# EAGLE design neue_schaltung (EAGLE 6.5.0)
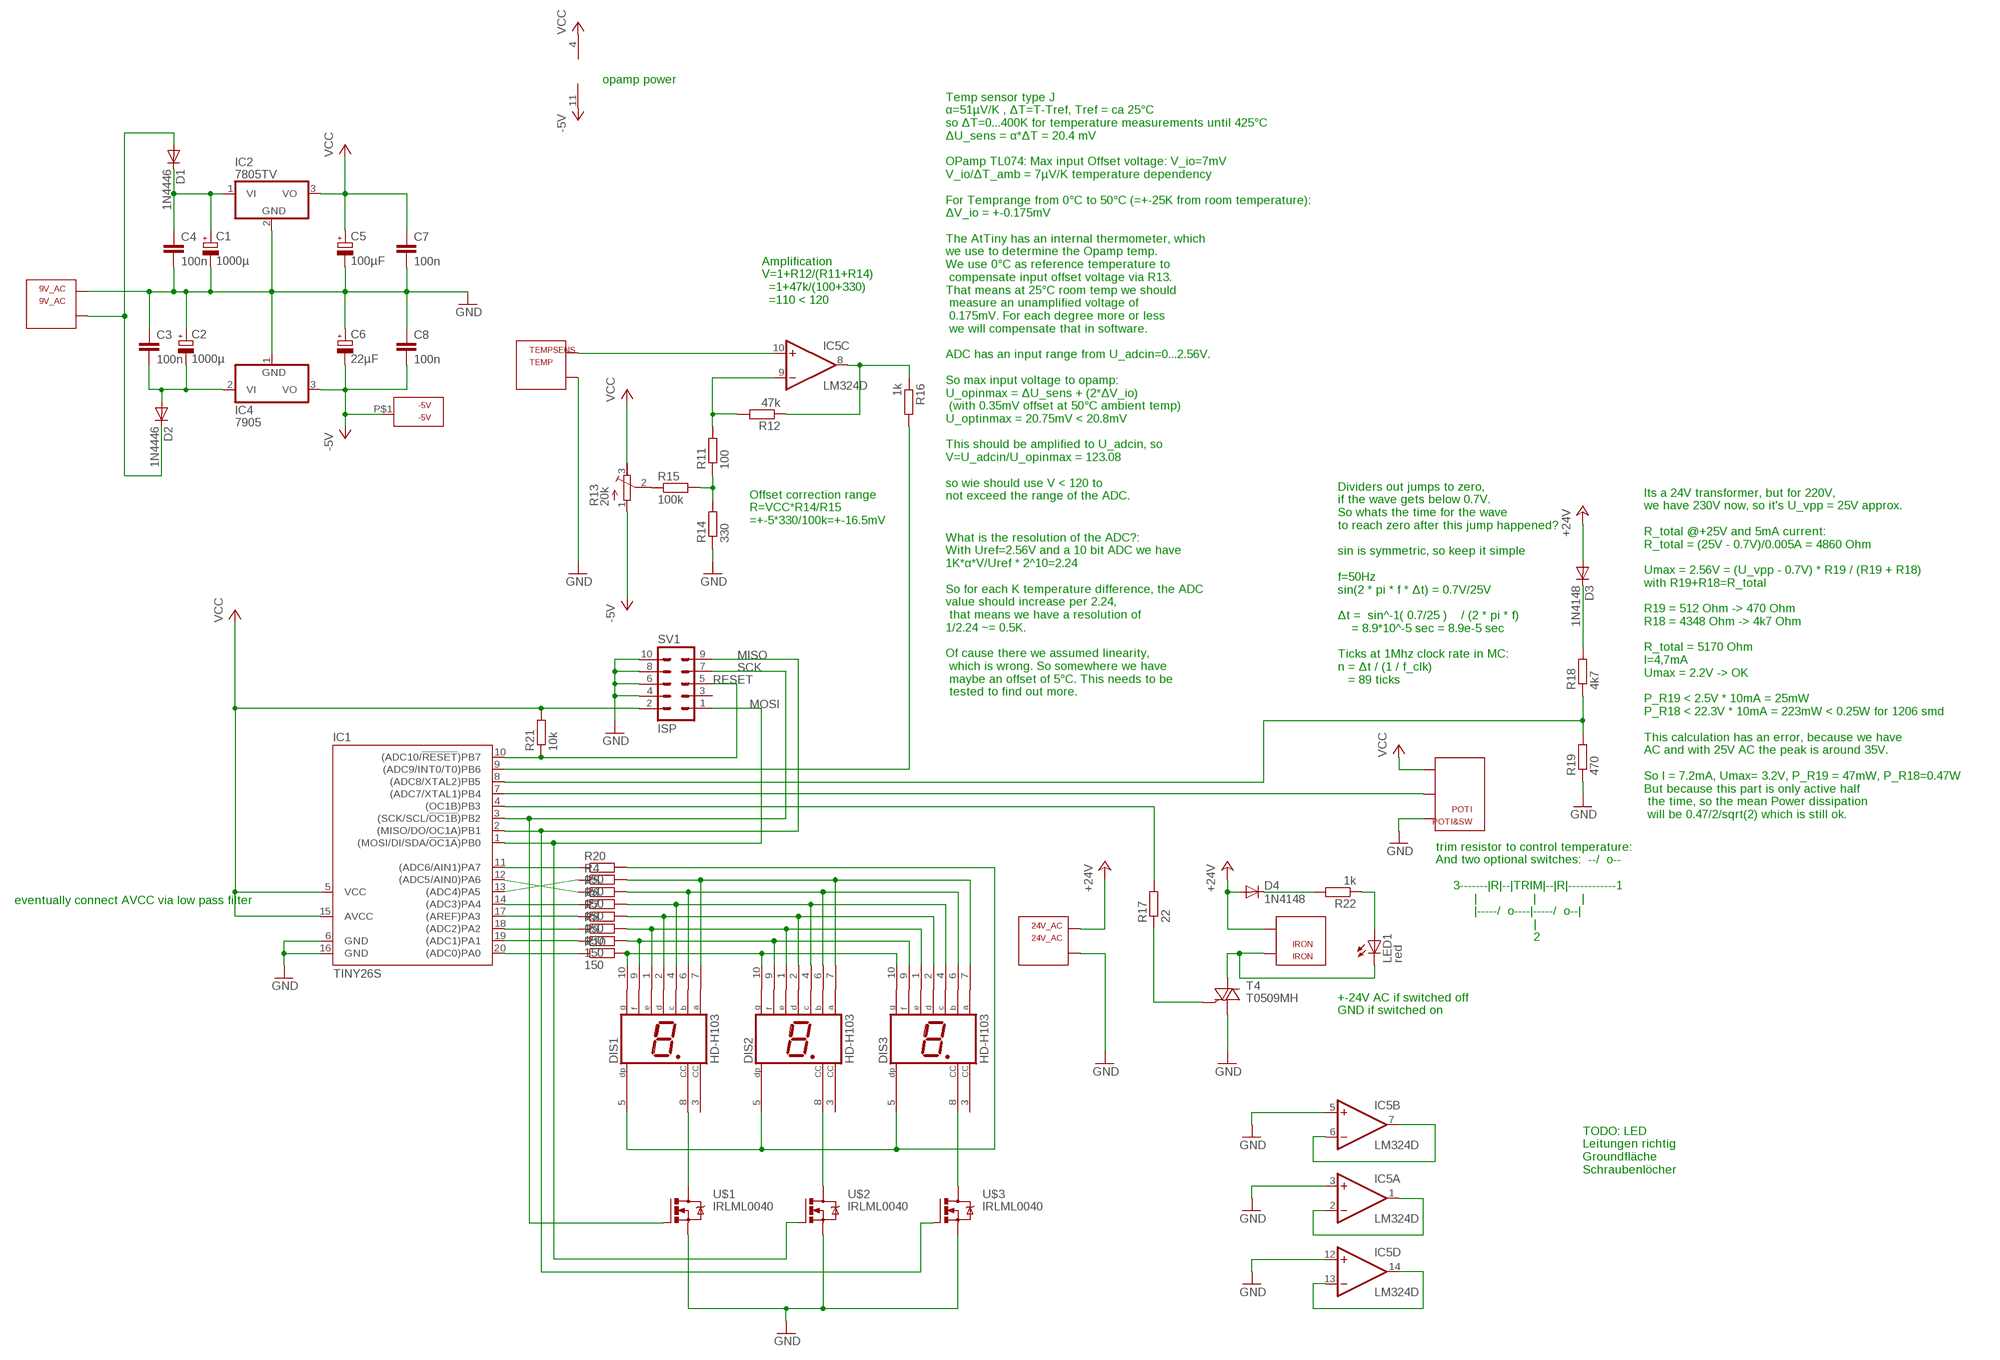
[diagram p0: schematic, sheet 1]

## Parts
9V_AC  9V_AC  WIREPADX2  [WIREPADX2_2H]
24V_AC  24V_AC  WIREPADX2_BIG  [WIREPADX2_2H_BIG]
-5V  -5V  WIREPAD  [WIREPAD_2H]
C1  1000µ  CPOL-EUE5-10.5  [E5-10,5]
C2  1000µ  CPOL-EUE5-10.5  [E5-10,5]
C3  100n  C-EUC0805  [C0805]
C4  100n  C-EUC0805  [C0805]
C5  100µF  CPOL-EUE2-5  [E2-5]
C6  22µF  CPOL-EUE2-5  [E2-5]
C7  100n  C-EUC0805  [C0805]
C8  100n  C-EUC0805  [C0805]
D1  1N4446  [DO35-10]
D2  1N4446  [DO35-10]
D3  1N4148  1N4148DO35-10  [DO35-10]
D4  1N4148  1N4148DO35-10  [DO35-10]
DIS1  HD-H103  [HDSP-M]
DIS2  HD-H103  [HDSP-M]
DIS3  HD-H103  [HDSP-M]
IC1  TINY26S  [SO20L]
IC2  7805TV  [TO220V]
IC4  7905  7905T  [TO220H]
IC5  LM324D  [SO14]
IRON  IRON  WIREPADX2_BIG  [WIREPADX2_2H_BIG]
LED1  red  LED5MM  [LED5MM]
POTI&SW  POTI  WIREPADX3  [WIREPADX3_2H]
R4  150  R-EU_M1206  [M1206]
R5  150  R-EU_M1206  [M1206]
R6  150  R-EU_M1206  [M1206]
R7  150  R-EU_M1206  [M1206]
R8  150  R-EU_M1206  [M1206]
R9  150  R-EU_M1206  [M1206]
R10  150  R-EU_M1206  [M1206]
R11  100  R-EU_M1206  [M1206]
R12  47k  R-EU_M1206  [M1206]
R13  20k  R-TRIMM64W  [RTRIM64W]
R14  330  R-EU_M1206  [M1206]
R15  100k  R-EU_M1206  [M1206]
R16  1k  R-EU_M1206  [M1206]
R17  22  R-EU_M1206  [M1206]
R18  4k7  R-EU_M1206  [M1206]
R19  470  R-EU_M1206  [M1206]
R20  150  R-EU_M1206  [M1206]
R21  10k  R-EU_M1206  [M1206]
R22  1k  R-EU_M1206  [M1206]
SV1  ISP  ML10  [ML10]
T4  T0509MH  BT136  [TO220AB]
TEMPSENS  TEMP  WIREPADX2  [WIREPADX2_2H]
U$1  IRLML0040  [MICRO3]
U$2  IRLML0040  [MICRO3]
U$3  IRLML0040  [MICRO3]

## Nets
+24V: 24V_AC.P$1 D3.A D4.A IRON.P$2
-5V: -5V.P$1 C6.- C8.2 IC4.3(VO) IC5.11(P:V-) R13.1(E)
GND: 9V_AC.P$1 24V_AC.P$2 C1.- C2.+ C3.1 C4.2 C5.- C6.+ C7.2 C8.1 IC1.6(GND) IC1.16(GND) IC2.2(GND) IC4.1(GND) IC5.3(A:+IN) IC5.5(B:+IN) IC5.12(D:+IN) POTI&SW.P$1 R14.1 R19.1 SV1.4 SV1.6 SV1.8 SV1.10 T4.1(A1) TEMPSENS.P$2 U$1.2(S) U$2.2(S) U$3.2(S)
MISO: IC1.2((MISO/DO/OC1A)PB1) SV1.9 U$3.1(G)
MOSI: IC1.1((MOSI/DI/SDA/!OC1A!)PB0) SV1.1 U$2.1(G)
N$1: DIS1.10(G) DIS2.10(G) DIS3.10(G) R10.2
N$2: DIS1.9(F) DIS2.9(F) DIS3.9(F) R9.2
N$3: DIS1.1(E) DIS2.1(E) DIS3.1(E) R8.2
N$4: DIS1.2(D) DIS2.2(D) DIS3.2(D) R7.2
N$5: DIS1.4(C) DIS2.4(C) DIS3.4(C) R6.2
N$6: DIS1.6(B) DIS2.6(B) DIS3.6(B) R5.2
N$7: DIS1.7(A) DIS2.7(A) DIS3.7(A) R4.2
N$8: DIS1.5(DP) DIS2.5(DP) DIS3.5(DP) R20.2
N$9: IC1.12((ADC5/AIN0)PA6) R5.1
N$10: IC1.13((ADC4)PA5) R4.1
N$11: IC1.14((ADC3)PA4) R6.1
N$12: IC1.17((AREF)PA3) R7.1
N$13: IC1.18((ADC2)PA2) R8.1
N$14: IC1.19((ADC1)PA1) R9.1
N$15: IC1.20((ADC0)PA0) R10.1
N$16: DIS1.8(CC) U$1.3(D)
N$17: DIS2.8(CC) U$2.3(D)
N$18: DIS3.8(CC) U$3.3(D)
N$19: IC5.10(C:+IN) TEMPSENS.P$1
N$21: R13.2(S) R15.1
N$22: 9V_AC.P$2 D1.A D2.C
N$24: C2.- C3.2 D2.A IC4.2(VI)
N$25: C1.+ C4.1 D1.C IC2.1(VI)
N$26: IC5.9(C:-IN) R11.2 R12.2
N$27: IC1.9((ADC9/INT0/T0)PB6) R16.2
N$29: R11.1 R14.2 R15.2
N$30: IC5.8(C:OUT) R12.1 R16.1
N$31: IRON.P$1 LED1.K(C) T4.2(A2)
N$32: R17.1 T4.3(G)
N$33: IC1.4((OC1B)PB3) R17.2
N$34: IC1.7((ADC7/XTAL1)PB4) POTI&SW.P$2
N$35: IC1.8((ADC8/XTAL2)PB5) R18.1 R19.2
N$36: D3.C R18.2
N$37: IC1.11((ADC6/AIN1)PA7) R20.1
N$38: D4.C R22.2
N$39: IC5.6(B:-IN) IC5.7(B:OUT)
N$40: IC5.1(A:OUT) IC5.2(A:-IN)
N$41: IC5.13(D:-IN) IC5.14(D:OUT)
N$42: LED1.A R22.1
RESET: IC1.10((ADC10/!RESET!)PB7) R21.1 SV1.5
SCK: IC1.3((SCK/SCL/!OC1B!)PB2) SV1.7 U$1.1(G)
VCC: C5.+ C7.1 IC1.5(VCC) IC1.15(AVCC) IC2.3(VO) IC5.4(P:V+) POTI&SW.P$3 R13.3(A) R21.2 SV1.2
Unconnected: DIS1.3(CC) DIS2.3(CC) DIS3.3(CC) SV1.3

## Notes on the sheet
- opamp power
- Amplification
  V=1+R12/(R11+R14)
    =1+47k/(100+330)
    =110 < 120
- Temp sensor type J
  α=51µV/K , ΔT=T-Tref, Tref = ca 25°C
  so ΔT=0...400K for temperature measurements until 425°C
  ΔU_sens = α*ΔT = 20.4 mV
  
  OPamp TL074: Max input Offset voltage: V_io=7mV
  V_io/ΔT_amb = 7µV/K temperature dependency
  
  For Temprange from 0°C to 50°C (=+-25K from room temperature):
  ΔV_io = +-0.175mV
  
  The AtTiny has an internal thermometer, which
  we use to determine the Opamp temp.
  We use 0°C as reference temperature to
   compensate input offset voltage via R13.
  That means at 25°C room temp we should
   measure an unamplified voltage of
   0.175mV. For each degree more or less
   we will compensate that in software.
  
  ADC has an input range from U_adcin=0...2.56V.
  
  So max input voltage to opamp:
  U_opinmax = ΔU_sens + (2*ΔV_io)
   (with 0.35mV offset at 50°C ambient temp)
  U_optinmax = 20.75mV < 20.8mV
  
  This should be amplified to U_adcin, so
  V=U_adcin/U_opinmax = 123.08
  
  so wie should use V < 120 to 
  not exceed the range of the ADC.
- Offset correction range
  R=VCC*R14/R15
  =+-5*330/100k=+-16.5mV
- Dividers out jumps to zero, 
  if the wave gets below 0.7V.
  So whats the time for the wave 
  to reach zero after this jump happened?
  
  sin is symmetric, so keep it simple
  
  f=50Hz
  sin(2 * pi * f * Δt) = 0.7V/25V
  
  Δt =  sin^-1( 0.7/25 )    / (2 * pi * f) 
      = 8.9*10^-5 sec = 8.9e-5 sec
  
  Ticks at 1Mhz clock rate in MC:
  n = Δt / (1 / f_clk)
     = 89 ticks
- What is the resolution of the ADC?:
  With Uref=2.56V and a 10 bit ADC we have
  1K*α*V/Uref * 2^10=2.24
  
  So for each K temperature difference, the ADC
  value should increase per 2.24,
   that means we have a resolution of 
  1/2.24 ~= 0.5K.
   
  Of cause there we assumed linearity,
   which is wrong. So somewhere we have
   maybe an offset of 5°C. This needs to be
   tested to find out more.
- Its a 24V transformer, but for 220V,
  we have 230V now, so it's U_vpp = 25V approx.
  
  R_total @+25V and 5mA current:
  R_total = (25V - 0.7V)/0.005A = 4860 Ohm
  
  Umax = 2.56V = (U_vpp - 0.7V) * R19 / (R19 + R18) 
  with R19+R18=R_total
  
  R19 = 512 Ohm -> 470 Ohm
  R18 = 4348 Ohm -> 4k7 Ohm
  
  R_total = 5170 Ohm
  I=4,7mA
  Umax = 2.2V -> OK
  
  P_R19 < 2.5V * 10mA = 25mW
  P_R18 < 22.3V * 10mA = 223mW < 0.25W for 1206 smd
  
  This calculation has an error, because we have 
  AC and with 25V AC the peak is around 35V.
  
  So I = 7.2mA, Umax= 3.2V, P_R19 = 47mW, P_R18=0.47W
  But because this part is only active half
   the time, so the mean Power dissipation
   will be 0.47/2/sqrt(2) which is still ok.
- eventually connect AVCC via low pass filter
- trim resistor to control temperature:
  And two optional switches:  --/  o--
  
       3-------|R|--|TRIM|--|R|------------1
             |                |             |
             |-----/  o----|-----/  o--|
                              |
                              2
- +-24V AC if switched off
  GND if switched on
- TODO: LED
  Leitungen richtig
  Groundfläche
  Schraubenlöcher

## Library data of the parts
9V_AC TEMPSENS = pxwirepad:WIREPADX2
24V_AC IRON = pxwirepad:WIREPADX2_BIG
-5V = pxwirepad:WIREPAD: Wirepad with strain relief
C1 C2 C5 C6 = rcl:CPOL-EU: POLARIZED CAPACITOR, European symbol
C3 C4 C7 C8 = rcl:C-EU: CAPACITOR, European symbol
D1 D2 = diode:1N4446: DIODE high speed (Philips)
D3 D4 = diode:1N4148: DIODE high speed (Philips)
DIS1-DIS3 = display-hp:HD-H103: LED DISPLAY 1-character 7 segment, decimal point right; OC_FARNELL: unknown; OC_NEWARK: unknown
IC1 = atmel:TINY26*: 8-bit AVR Microcontroller with 2K Bytes Flash Source: http://www.atmel.com .. doc1477.pdf; MPN: ATTINY261-20SU; OC_FARNELL: 1455147; OC_NEWARK: 58M3783
IC2 = linear:78*: Positive VOLTAGE REGULATOR Source: http://cache.national.com/ds/LM/LM78L05.pdf http://www.fairchildsemi.com/ds/LM/LM7805.pdf
IC4 = linear:79*: Negative VOLTAGE REGULATOR
IC5 = linear:LM324: OP AMP
LED1 = led:LED: LED OSRAM: - CHIPLED LG R971, LG N971, LY N971, LG Q971, LY Q971, LO R971, LY R971 LH N974, LH R974 LS Q976, LO Q976, LY Q976 LO Q996 - Hyper CHIPLED LW Q18S LB Q993, LB Q99A, LB R99A - SideLED LS A670, LO A670, LY A670, LG A670, LP A670 LB A673, LV A673, LT A673, LW A673 LH A674 LY A675 LS A676, LA A676, LO A676, LY A676, LW A676 LS A679, LY A679, LG A679 - Hyper Micro SIDELED® LS Y876, LA Y876, LO Y876, LY Y876 LT Y87S - SmartLED LW L88C, LW L88S LB L89C, LB L89S, LG L890 LS L89K, LO L89K, LY L89K LS L896, LA L896, LO L896, LY L896 - TOPLED LS T670, LO T670, LY T670, LG T670, LP T670 LSG T670, LSP T670, LSY T670, LOP T670, LYG T670 LG T671, LOG T671, LSG T671 LB T673, LV T673, LT T673, LW T673 LH T674 LS T676, LA T676, LO T676, LY T676, LB T676, LH T676, LSB T676, LW T676 LB T67C, LV T67C, LT T67C, LS T67K, LO T67K, LY T67K, LW E67C LS E67B, LA E67B, LO E67B, LY E67B, LB E67C, LV E67C, LT E67C LW T67C LS T679, LY T679, LG T679 LS T770, LO T770, LY T770, LG T770, LP T770 LB T773, LV T773, LT T773, LW T773 LH T774 LS E675, LA E675, LY E675, LS T675 LS T776, LA T776, LO T776, LY T776, LB T776 LHGB T686 LT T68C, LB T68C - Hyper Mini TOPLED® LB M676 - Mini TOPLED Santana® LG M470 LS M47K, LO M47K, LY M47K Source: http://www.osram.convergy.de LUXEON: - LUMILED® LXK2-PW12-R00, LXK2-PW12-S00, LXK2-PW14-U00, LXK2-PW14-V00 LXK2-PM12-R00, LXK2-PM12-S00, LXK2-PM14-U00 LXK2-PE12-Q00, LXK2-PE12-R00, LXK2-PE12-S00, LXK2-PE14-T00, LXK2-PE14-U00 LXK2-PB12-K00, LXK2-PB12-L00, LXK2-PB12-M00, LXK2-PB14-N00, LXK2-PB14-P00, LXK2-PB14-Q00 LXK2-PR12-L00, LXK2-PR12-M00, LXK2-PR14-Q00, LXK2-PR14-R00 LXK2-PD12-Q00, LXK2-PD12-R00, LXK2-PD12-S00 LXK2-PH12-R00, LXK2-PH12-S00 LXK2-PL12-P00, LXK2-PL12-Q00, LXK2-PL12-R00 Source: www.luxeon.com KINGBRIGHT: KA-3528ASYC Source: www.kingbright.com
POTI&SW = pxwirepad:WIREPADX3
R4-R12 R14-R22 = rcl:R-EU_: RESISTOR, European symbol
R13 = resistor:R-TRIMM: Trimm resistor
SV1 = con-ml:ML10: HARTING; OC_FARNELL: unknown; OC_NEWARK: unknown
T4 = triac:BT136: Triac BT136 series E sensitive gate Source: http://www.nxp.com/acrobat_download/datasheets/BT136_SERIES_E_2.pdf
U$1-U$3 = mosfet:IRLML0040

## Board
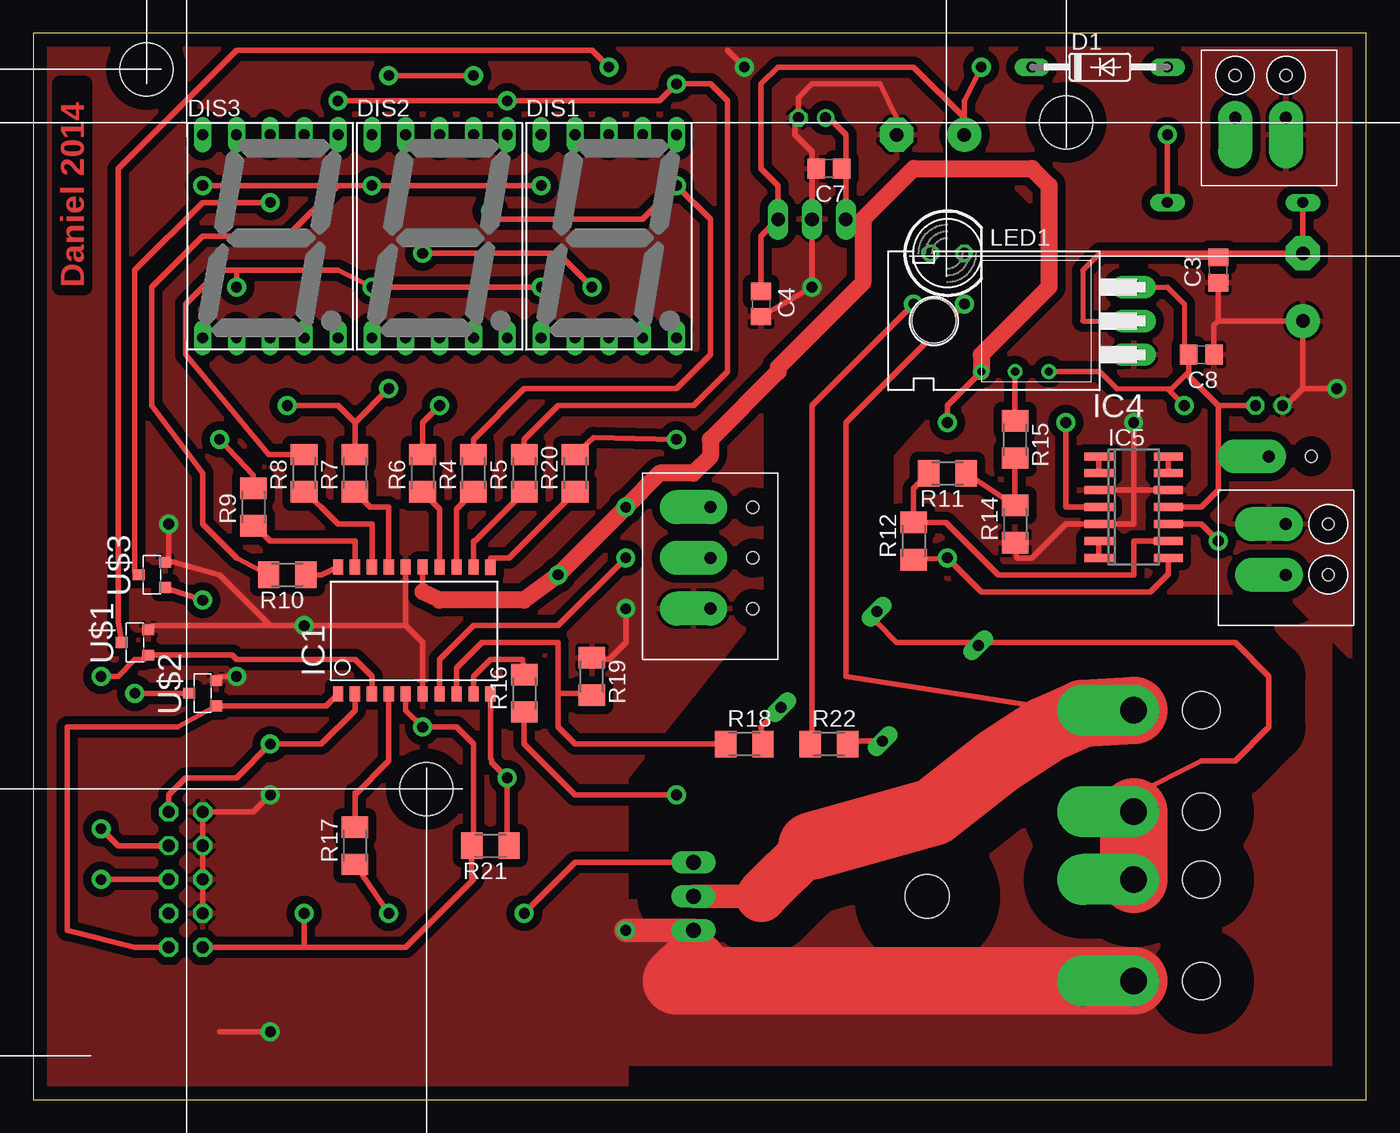
[diagram p1: board, top side]
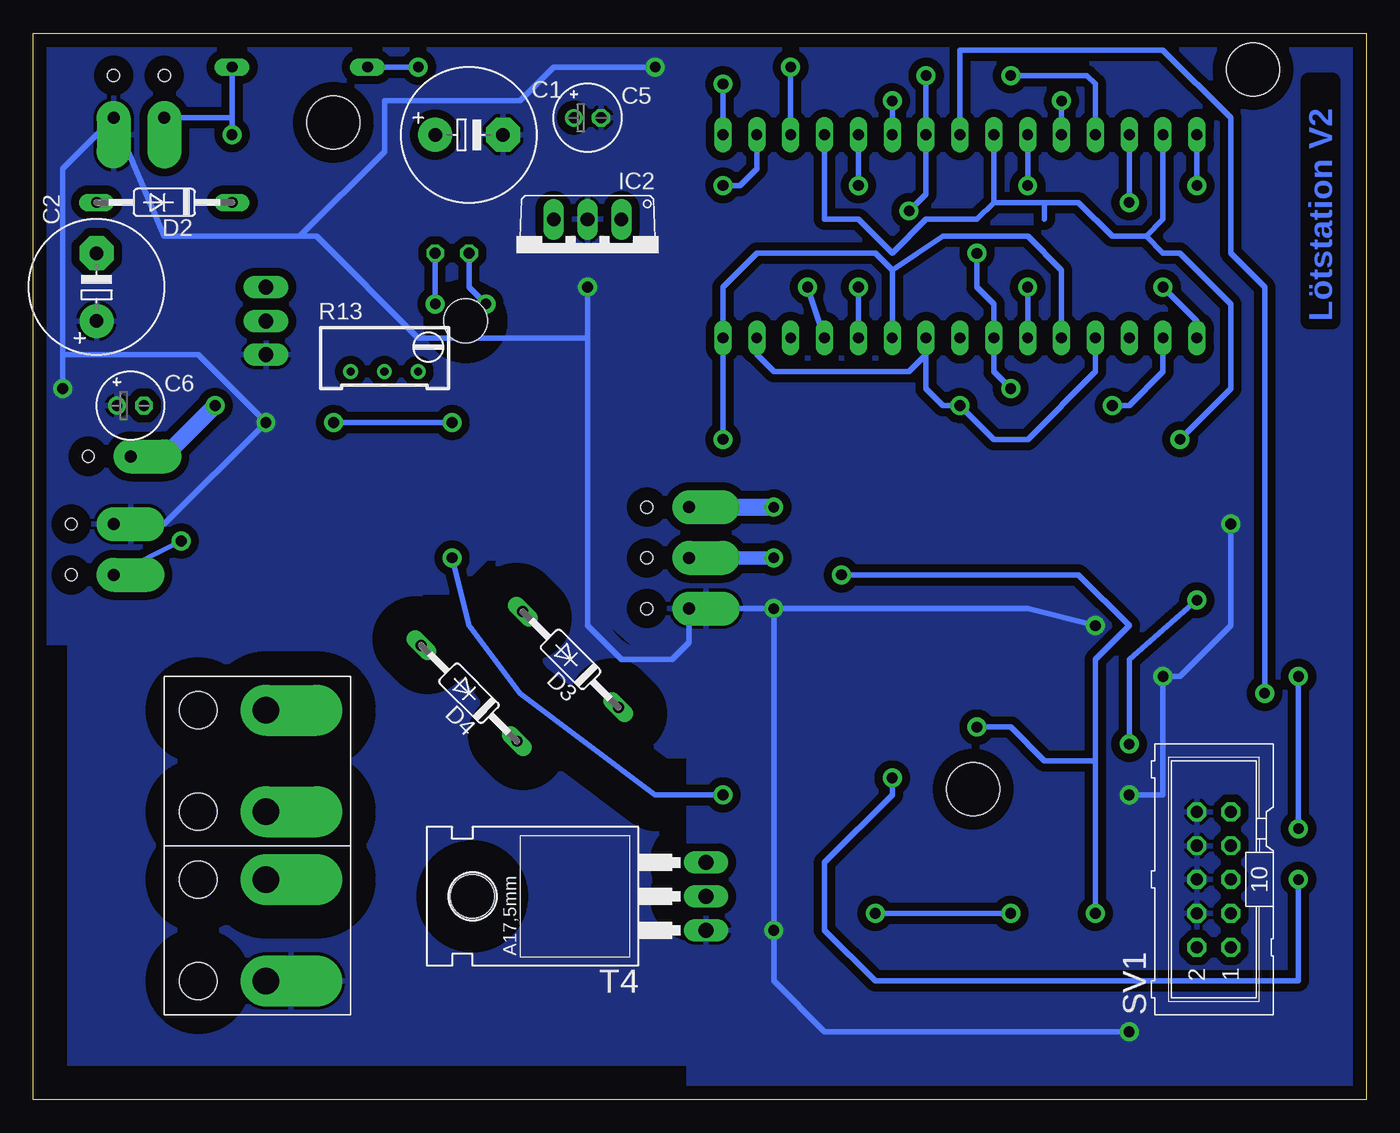
[diagram p2: board, bottom side, seen from below]

Size 100 x 80 mm. Coordinates in mm from the lower left corner, seen from the top.
Outline: 0,0 100,0 100,80 0,80 0,0
Copper layers (1*16): Top 0.035mm / dielectric 1.5mm / Bottom 0.035mm
Design rules "default": minimum track width 10mil, minimum drill 24mil, track to track 8mil, track to pad 8mil, pad to pad 8mil, via to via 8mil, smd to smd 8mil, copper to edge 40mil, drill to drill 8mil, minimum pad ring 10mil, minimum via ring 8mil, stop-mask expansion 4mil, vias tented up to drill 0mil, thermal gap 10mil
Holes 4 mm at 8.5,77.3 77.5,73.3 29.5,23.3

### Footprints (pad centres in the part's own frame; a part is rotated, then mirrored left to right if it is on the bottom)
WIREPADX2_2H = drill 0.9 pad 2.54 offset: P$1 0,0; P$2 0,-3.81 | hole 0.9: -3.175,0; -3.175,-3.81
WIREPADX2_2H_BIG = drill 2 pad 3.81 offset: P$1 0,0; P$2 0,-7.62 | hole 2.8: -5.08,0; -5.08,-7.62
WIREPAD_2H = drill 0.9 pad 2.54 offset: P$1 2.54,0 | hole 0.9: -0.635,0
E5-10,5 = drill 1.016 pad 2.54: + -2.54,0 | drill 1.016 pad 2.54 octagon: - 2.54,0
C0805 = smd 1.3 x 1.5: 1 -0.95,0; 2 0.95,0
E2-5 = drill 0.813 pad 1.27: + -1.016,0 | drill 0.813 pad 1.27 octagon: - 1.016,0
DO35-10 = drill 0.813 long: A 5.08,0; C -5.08,0
HDSP-M = drill 0.813 long: 1 -5.08,-7.62; 2 -2.54,-7.62; 3 0,-7.62; 4 2.54,-7.62; 5 5.08,-7.62; 6 5.08,7.62; 7 2.54,7.62; 8 0,7.62; 9 -2.54,7.62; 10 -5.08,7.62
SO20L = smd 0.762 x 1.143: 1 -5.08,-5.131; 2 -3.81,-5.131; 3 -2.54,-5.131; 4 -1.27,-5.131; 5 0,-5.131; 6 1.27,-5.131; 7 2.54,-5.131; 8 3.81,-5.131; 9 5.08,-5.131; 10 6.35,-5.131; 11 6.35,4.369; 12 5.08,4.394; 13 3.81,4.394; 14 2.54,4.394; 15 1.27,4.394; 16 0,4.394; 17 -1.27,4.394; 18 -2.54,4.394; 19 -3.81,4.394; 20 -5.08,4.394
TO220V = drill 1.016 long: 1 -2.54,-2.54; 2 0,-2.54; 3 2.54,-2.54
TO220H = drill 1.118 long: 1 -2.54,-10.16; 2 0,-10.16; 3 2.54,-10.16 | hole 3.302: 0,4.826
SO14 = smd 0.6 x 2.2: 1 -3.81,-2.6; 2 -2.54,-2.6; 3 -1.27,-2.6; 4 0,-2.6; 5 1.27,-2.6; 6 2.54,-2.6; 7 3.81,-2.6; 8 3.81,2.6; 9 2.54,2.6; 10 1.27,2.6; 11 0,2.6; 12 -1.27,2.6; 13 -2.54,2.6; 14 -3.81,2.6
LED5MM = drill 0.813 octagon: A -1.27,0; K 1.27,0
WIREPADX3_2H = drill 0.9 pad 2.54 offset: P$1 0,0; P$2 0,-3.81; P$3 0,-7.62 | hole 0.9: -3.175,0; -3.175,-3.81; -3.175,-7.62
M1206 = smd 1.6 x 2: 1 -1.4,0; 2 1.4,0
RTRIM64W = drill 0.61: 1 1.27,-2.54; 2 1.27,0; 3 1.27,2.54
ML10 = drill 0.914 octagon: 1 -5.08,-1.27; 2 -5.08,1.27; 3 -2.54,-1.27; 4 -2.54,1.27; 5 0,-1.27; 6 0,1.27; 7 2.54,-1.27; 8 2.54,1.27; 9 5.08,-1.27; 10 5.08,1.27
TO220AB = drill 1.118 long: 1 -2.54,-6.35; 2 0,-6.35; 3 2.54,-6.35 | hole 3.302: 0,11.176
MICRO3 = smd 0.8 x 0.9: 1 -0.95,-1; 2 0.95,-1; 3 0,1

### Placement (x,y rotation side)
9V_AC  93.98,73.66 270 top
24V_AC  82.55,16.51 0 bottom
-5V  95.25,48.26 180 top
C1  67.31,72.39 0 bottom
C2  95.25,60.96 90 bottom
C3  88.9,62.23 90 top
C4  54.61,59.69 270 top
C5  58.42,73.66 0 bottom
C6  92.71,52.07 0 bottom
C7  59.69,69.85 180 top
C8  87.63,55.88 180 top
D1  80.01,77.47 0 top
D2  90.17,67.31 180 bottom
D3  59.69,33.02 135 bottom
D4  67.31,30.48 135 bottom
DIS1  43.18,64.77 0 top
DIS2  30.48,64.77 0 top
DIS3  17.78,64.77 0 top
IC1  27.94,35.56 0 top
IC2  58.42,63.5 180 bottom
IC4  72.39,58.42 90 top
IC5  82.55,44.45 270 top
IRON  82.55,29.21 0 bottom
LED1  68.58,63.5 0 top
POTI&SW  50.8,36.83 180 top
R4  33.02,46.99 90 top
R5  36.83,46.99 90 top
R6  29.21,46.99 90 top
R7  24.13,46.99 90 top
R8  20.32,46.99 90 top
R9  16.51,44.45 90 top
R10  19.05,39.37 180 top
R11  68.58,46.99 180 top
R12  66.04,41.91 90 top
R13  73.66,55.88 270 bottom
R14  73.66,43.18 90 top
R15  73.66,49.53 270 top
R16  36.83,30.48 90 top
R17  24.13,19.05 90 top
R18  53.34,26.67 0 top
R19  41.91,31.75 270 top
R20  40.64,46.99 90 top
R21  34.29,19.05 180 top
R22  59.69,26.67 0 top
SV1  11.43,16.51 90 bottom
T4  55.88,15.24 90 bottom
TEMPSENS  93.98,39.37 180 top
U$1  7.62,34.29 90 top
U$2  12.7,30.48 90 top
U$3  8.89,39.37 90 top

### Tracks (layer width: path | path; a pad name or v marks a point on that pad's centre or on a via)
+24V
  Top 0.406: IRON.P$2 82.55,22.86 87.63,25.4 90.17,25.4 92.71,27.94 92.71,31.75 90.17,34.29 71.12,34.29 | D3.A 63.28,35.78 64.77,34.29 71.12,34.29 | 71.12,34.29 D4.A | D4.A | D4.A 71.12,34.29
  Top 5.08: IRON.P$2 24V_AC.P$1
-5V  (via drill 0.8 pad 1.42)
  Top 0.375: IC4.3 85.09,60.96 86.36,59.69 86.36,56.2 C8.2 | 80.01,54.61 81.28,53.34 85.09,53.34 | 85.09,53.34 v86.36,52.07 | 85.09,53.34 85.41,53.34 86.68,54.61
  Top 0.406: C8.2 86.68,54.61 86.68,54.29 88.9,52.07 | 88.9,52.07 C6.- | 88.9,52.07 88.9,45.72 87.63,44.45 IC5.11 | R13.1 80.01,54.61
  Bottom 1.27: -5V.P$1 90.17,48.26 v86.36,52.07
GND  (via drill 0.8 pad 1.42)
  Top 0.406: 17.78,35.56 13.97,39.37 10.48,40.32 U$3.2 10.16,40.59 v10.16,43.18 | IC1.16 27.94,35.56 | 27.94,35.56 29.21,34.29 IC1.6 | 17.78,35.56 8.94,35.56 U$1.2 | v15.24,31.75 14.02,31.75 U$2.2 | C4.2 v58.42,60.96 IC2.2 58.42,69.85 | 58.42,69.85 58.42,71.12 57.15,72.39 57.15,73.41 C5.- 57.4,75.18 58.42,76.2 63.5,76.2 64.77,73.66 C1.- | 88.9,58.42 C2.+ 95.25,53.34 | C8.1 88.58,58.1 88.9,58.42 | 88.9,58.42 C3.1 | C6.+ 93.98,52.07 95.25,53.34 | 82.55,45.72 IC5.12 | IC5.3 82.55,45.72 | 82.55,45.72 82.55,43.18 IC5.5 77.47,43.18 74.93,40.64 73.79,40.64 R14.1 | v97.79,53.34 95.25,53.34 | v82.55,50.8 82.55,45.72 | SV1.4 SV1.6 SV1.8 SV1.10 16.51,21.59 v17.78,22.86 | C7.2 58.42,69.85 | v44.45,36.83 44.45,34.29 43.18,33.02 42.04,33.02 R19.1 | 17.78,35.56 v20.32,35.56 27.94,35.56 | v17.78,5.08 13.97,5.08 | v53.34,77.47 52.07,78.74
  Top 1.778: 49.53,10.16 T4.1 v44.45,12.7
  Top 5.08: 49.53,10.16 48.26,8.89 24V_AC.P$2
  Bottom 0.406: v10.16,43.18 10.16,35.56 13.97,31.75 v15.24,31.75 15.24,22.86 v17.78,22.86 | 80.01,64.77 90.17,64.77 9V_AC.P$1 97.79,69.85 97.79,55.88 | 80.01,64.77 78.74,64.77 71.12,57.15 58.42,57.15 | 97.79,55.88 v97.79,53.34 | 97.79,55.88 87.63,55.88 v82.55,50.8 90.17,43.18 TEMPSENS.P$2 | v58.42,60.96 58.42,57.15 | 58.42,57.15 58.42,35.56 55.88,33.02 52.07,33.02 50.8,34.29 POTI&SW.P$1 v44.45,36.83 | v44.45,36.83 25.4,36.83 v20.32,35.56 | v44.45,36.83 v44.45,12.7 44.45,8.89 40.64,5.08 v17.78,5.08 | 80.01,64.77 73.66,71.12 73.66,74.93 63.5,74.93 60.96,77.47 v53.34,77.47
  pour Bottom (isolate 0.61): 0,80.01 0,0 50.8,0 50.8,30.48 62.23,40.64 66.04,40.64 68.58,38.1 74.93,38.1 78.74,34.29 100.33,34.29 100.33,80.01
  pour Bottom (isolate 2.54): 50.8,0 100.33,0 100.33,34.29 78.74,34.29 74.93,38.1 68.58,38.1 66.04,40.64 62.23,40.64 60.96,39.37 50.8,30.48
  pour Top (isolate 0.61): 0,80.01 100.33,80.01 100.33,31.75 93.98,38.1 71.12,38.1 64.77,40.64 64.77,48.26 74.93,59.69 74.93,67.31 72.39,69.85 66.04,69.85 62.23,66.04 62.23,60.96 54.61,53.34 54.61,36.83 44.45,24.13 44.45,0 0,0
  pour Top (isolate 2.54): 44.45,0 44.45,24.13 55.88,38.1 100.33,38.1 100.33,0
MISO  (via drill 0.8 pad 1.42)
  Top 0.406: U$3.1 9.89,38.37 v12.7,37.47 | IC1.2 24.13,29.21 21.59,26.67 v17.78,26.67 15.24,24.13 11.43,24.13 10.16,22.86 SV1.9
  Bottom 0.406: v12.7,37.47 17.78,33.02 v17.78,26.67
MOSI
  Top 0.406: IC1.1 21.96,29.53 U$2.1 10.84,27.94 2.54,27.94 2.54,12.7 7.62,11.43 SV1.1
N$1  (via drill 0.8 pad 1.42)
  Top 0.406: R10.2 15.24,40.64 12.7,43.18 12.7,46.99 8.89,52.07 8.89,60.96 12.7,64.77 19.05,64.77 22.86,68.58 | 22.86,68.58 v12.7,68.58 | 22.86,68.58 v25.4,68.58 v38.1,68.58
  Bottom 0.406: v12.7,68.58 DIS3.10 | v25.4,68.58 DIS2.10 | DIS1.10 v38.1,68.58
N$2  (via drill 0.8 pad 1.42)
  Top 0.406: v13.97,49.53 16.51,46.86 R9.2
  Bottom 0.406: 16.51,64.77 15.24,66.04 DIS3.9 | 16.51,64.77 19.05,64.77 21.59,67.31 24.13,67.31 | 24.13,67.31 27.94,67.31 | DIS2.9 27.94,67.31 | 27.94,67.31 29.21,66.04 33.02,66.04 35.56,63.5 38.1,66.04 40.64,66.04 DIS1.9 | 24.13,66.04 24.13,67.31 | 16.51,64.77 15.24,63.5 13.97,63.5 10.16,59.69 10.16,53.34 v13.97,49.53
N$3  (via drill 0.8 pad 1.42)
  Top 0.406: 15.24,62.23 22.86,62.23 v25.4,60.96 v38.1,60.96 | 15.24,62.23 v15.24,60.96 | R8.2 17.65,48.39 11.43,55.88 11.43,59.69 13.97,62.23 15.24,62.23
  Bottom 0.406: DIS2.1 v25.4,60.96 | v15.24,60.96 12.7,58.42 DIS3.1 | DIS1.1 v38.1,60.96
N$4  (via drill 0.8 pad 1.42)
  Top 0.406: v29.21,63.5 39.37,63.5 v41.91,60.96 | R7.2 24.13,50.8 | 24.13,50.8 v26.67,53.34 | 24.13,50.8 22.86,52.07 v19.05,52.07
  Bottom 0.406: DIS1.2 v41.91,60.96 | v29.21,63.5 29.21,60.96 27.94,59.69 DIS2.2 27.94,54.61 v26.67,53.34 | v19.05,52.07 17.78,52.07 15.24,54.61 DIS3.2
N$5  (via drill 0.8 pad 1.42)
  Top 0.406: R6.2 29.21,50.8 v30.48,52.07
  Bottom 0.406: DIS1.4 45.72,55.88 44.45,54.61 34.29,54.61 33.02,55.88 DIS2.4 33.02,53.34 31.75,52.07 v30.48,52.07 27.94,49.53 25.4,49.53 20.32,54.61 DIS3.4
N$6  (via drill 0.8 pad 1.42)
  Top 0.406: R5.2 36.83,49.53 39.37,52.07 49.53,52.07 52.07,54.61 52.07,74.93 50.8,76.2 v48.26,76.2 46.99,74.93 v35.56,74.93 v22.86,74.93
  Bottom 0.406: v35.56,74.93 DIS2.6 | DIS1.6 v48.26,76.2 | DIS3.6 v22.86,74.93
N$7  (via drill 0.8 pad 1.42)
  Top 0.406: R4.2 33.02,49.53 36.83,53.34 48.26,53.34 50.8,55.88 50.8,66.04 v48.26,68.58 45.72,66.04 34.92,66.04 v34.29,66.67 | v26.67,76.83 v33.02,76.83
  Bottom 0.406: v48.26,68.58 46.99,68.58 45.72,69.85 DIS1.7 | DIS3.7 20.32,76.2 20.95,76.83 v26.67,76.83 | v33.02,76.83 DIS2.7 33.02,67.94 v34.29,66.67
N$8  (via drill 0.8 pad 1.42)
  Top 0.406: R20.2 42.04,49.66 v48.26,49.53
  Bottom 0.406: DIS3.5 22.86,62.23 25.4,64.77 31.75,64.77 35.56,62.23 | 35.56,62.23 DIS2.5 | 35.56,62.23 36.83,63.5 45.72,63.5 48.26,60.96 DIS1.5 v48.26,49.53
N$9
  Top 0.406: IC1.12 33.02,41.91 33.15,41.91 R5.1
N$10
  Top 0.406: IC1.13 31.75,44.32 R4.1
N$11
  Top 0.406: IC1.14 30.48,44.32 R6.1
N$12
  Top 0.406: IC1.17 26.67,44.45 25.27,44.45 R7.1
N$13
  Top 0.406: IC1.18 25.4,43.18 22.86,43.18 21.59,44.45 R8.1
N$14
  Top 0.406: IC1.19 24.13,41.91 17.78,41.91 16.64,43.05 R9.1
N$15
  Top 0.406: IC1.20 21.59,39.37 R10.1
N$16  (via drill 0.8 pad 1.42)
  Top 0.406: v43.18,77.47 41.91,78.74 15.24,78.74 6.35,69.85 6.35,35.83 U$1.3
  Bottom 0.406: v43.18,77.47 DIS1.8
N$17  (via drill 0.8 pad 1.42)
  Top 0.406: v7.62,30.48 U$2.3
  Bottom 0.406: DIS2.8 30.48,78.74 15.24,78.74 10.16,73.66 10.16,63.5 7.62,60.96 v7.62,30.48
N$18  (via drill 0.8 pad 1.42)
  Top 0.406: v17.78,67.31 12.7,67.31 7.62,62.23 7.62,39.64 U$3.3
  Bottom 0.406: DIS3.8 v17.78,67.31
N$19  (via drill 0.8 pad 1.42)
  Top 0.406: IC5.10 87.63,43.18 v88.9,41.91
  Bottom 0.406: v88.9,41.91 TEMPSENS.P$1
N$21
  Top 0.406: R15.1 R13.2
N$22  (via drill 0.8 pad 1.42)
  Top 0.406: v85.09,72.39 D2.C
  Bottom 0.406: 9V_AC.P$2 85.09,73.66 | D1.A 85.09,73.66 | 85.09,73.66 v85.09,72.39
N$24
  Top 0.375: 85.09,63.5 80.01,63.5 78.74,62.23 78.74,58.42 IC4.2 | C3.2 86.68,63.18 86.36,63.5
  Top 0.406: D2.A C2.- 86.36,63.5 85.09,63.5
N$25  (via drill 0.8 pad 1.42)
  Top 0.406: C4.1 54.61,64.77 IC2.1 55.88,68.58 54.61,69.85 54.61,76.2 55.88,77.47 66.04,77.47 69.85,73.66 C1.+ 69.85,74.93 v71.12,77.47
  Bottom 0.406: v71.12,77.47 D1.C
N$26
  Top 0.406: IC5.9 82.55,41.91 82.55,39.37 72.39,39.37 68.45,43.31 R12.2 66.04,45.85 R11.2
N$27
  Top 0.406: IC1.9 33.02,31.75 34.29,33.02 36.7,33.02 R16.2
N$29
  Top 0.406: R15.2 R14.2 R11.1
N$30  (via drill 0.8 pad 1.42)
  Top 0.406: IC5.8 85.15,39.43 83.82,38.1 71.12,38.1 v68.58,40.64 68.71,40.64 R12.1 | R16.1 36.83,26.67 40.64,22.86 v48.26,22.86
  Bottom 0.406: v48.26,22.86 53.34,22.86 63.5,30.48 67.31,35.56 v68.58,40.64
N$31  (via drill 0.8 pad 1.42)
  Top 0.406: v69.85,59.69 60.96,50.8 60.96,31.75 78.75,28.99
  Top 1.778: T4.2 54.61,15.24
  Top 3.81: 54.61,15.24 58.42,19.05
  Top 5.08: IRON.P$1 78.75,28.99 75.98,27.72 72.39,25.4 67.55,21.59 58.42,19.05
  Bottom 0.406: LED1.K v69.85,59.69
N$32  (via drill 0.8 pad 1.42)
  Top 0.406: v36.83,13.97 40.64,17.78 T4.3 | R17.1 v26.67,13.97
  Bottom 0.406: v26.67,13.97 v36.83,13.97
N$33
  Top 0.406: IC1.4 26.67,25.4 24.13,22.86 | 24.13,22.86 24.13,22.99 | 24.13,22.86 R17.2
N$34  (via drill 0.8 pad 1.42)
  Top 0.406: v44.45,40.64 39.37,35.56 33.02,35.56 30.48,33.02 IC1.7
  Bottom 1.016: POTI&SW.P$2 v44.45,40.64
N$35
  Top 0.406: IC1.8 31.75,32.38 33.66,34.29 39.37,34.29 39.37,30.48 | 39.37,30.48 41.78,30.48 R19.2 | 39.37,30.48 39.37,27.94 40.64,26.67 52.07,26.67 52.2,26.54 R18.1
N$36
  Top 0.406: R18.2 54.61,27.94 | 54.61,27.94 | 54.61,27.94 D3.C
N$37
  Top 0.406: IC1.11 34.29,40.64 35.69,40.64 R20.1
N$38
  Top 0.406: D4.C 62.14,26.89 R22.2
N$39
  Top 0.406: IC5.6 IC5.7
N$40
  Top 0.406: IC5.1 IC5.2
N$41
  Top 0.406: IC5.14 IC5.13
N$42  (via drill 0.8 pad 1.42)
  Top 0.406: v66.04,59.69 58.42,52.07 58.42,26.67 R22.1
  Bottom 0.406: LED1.A 67.31,60.96 v66.04,59.69
RESET  (via drill 0.8 pad 1.42)
  Top 0.406: SV1.5 v5.08,16.51 | IC1.10 34.29,25.59 34.4,25.49 34.4,25.3 v35.56,24.13 35.56,19.18 R21.1
  Bottom 0.406: v5.08,16.51 5.08,8.89 36.83,8.89 40.64,12.7 40.64,17.78 35.56,22.86 v35.56,24.13
SCK  (via drill 0.8 pad 1.42)
  Top 0.406: IC1.3 25.4,31.75 24.13,33.02 15.24,33.02 14.92,33.34 U$1.1 8.3,33.02 7.62,33.02 6.35,31.75 v5.08,31.75 | SV1.7 6.35,19.05 v5.08,20.32
  Bottom 0.406: v5.08,20.32 v5.08,31.75
VCC  (via drill 0.8 pad 1.42)
  Top 0.406: C5.+ 59.69,73.66 60.96,72.39 60.96,69.85 | 60.96,69.85 IC2.3 62.23,66.04 | IC5.4 77.47,44.45 v77.47,50.8 | v68.58,50.8 68.58,52.07 R13.3 | IC1.5 27.94,29.21 v29.21,27.94 31.75,27.94 33.02,26.67 33.02,19.05 R21.2 32.89,16.64 33.02,16.51 27.94,11.43 20.32,11.43 | SV1.2 20.32,11.43 | 29.21,38.1 IC1.15 | C7.1 60.96,69.85 | 55.88,54.61 55.88,54.93 | v20.32,13.97 20.32,11.43
  Top 1.27: R13.3 71.12,55.88 76.2,60.96 76.2,68.58 74.93,69.85 66.04,69.85 62.23,66.04 62.23,61.28 55.88,54.93 | 29.21,38.1 30.48,37.47 36.83,37.47 v39.37,39.37 v44.45,44.45 46.99,46.99 49.53,46.99 50.8,48.26 50.8,49.53 55.88,54.61
  Bottom 0.406: v77.47,50.8 v68.58,50.8 | v39.37,39.37 21.59,39.37 17.78,35.56 20.32,33.02 20.32,25.4 | 20.32,25.4 v20.32,13.97 | 20.32,25.4 24.13,25.4 26.67,27.94 v29.21,27.94
  Bottom 1.27: POTI&SW.P$3 v44.45,44.45

### Text on the board
Top: Daniel 2014
Bottom: Lötstation V2